# EAGLE schematic LiPoDisp (EAGLE 5.11)
BEST: Farnell 1096979 Bu 1097021
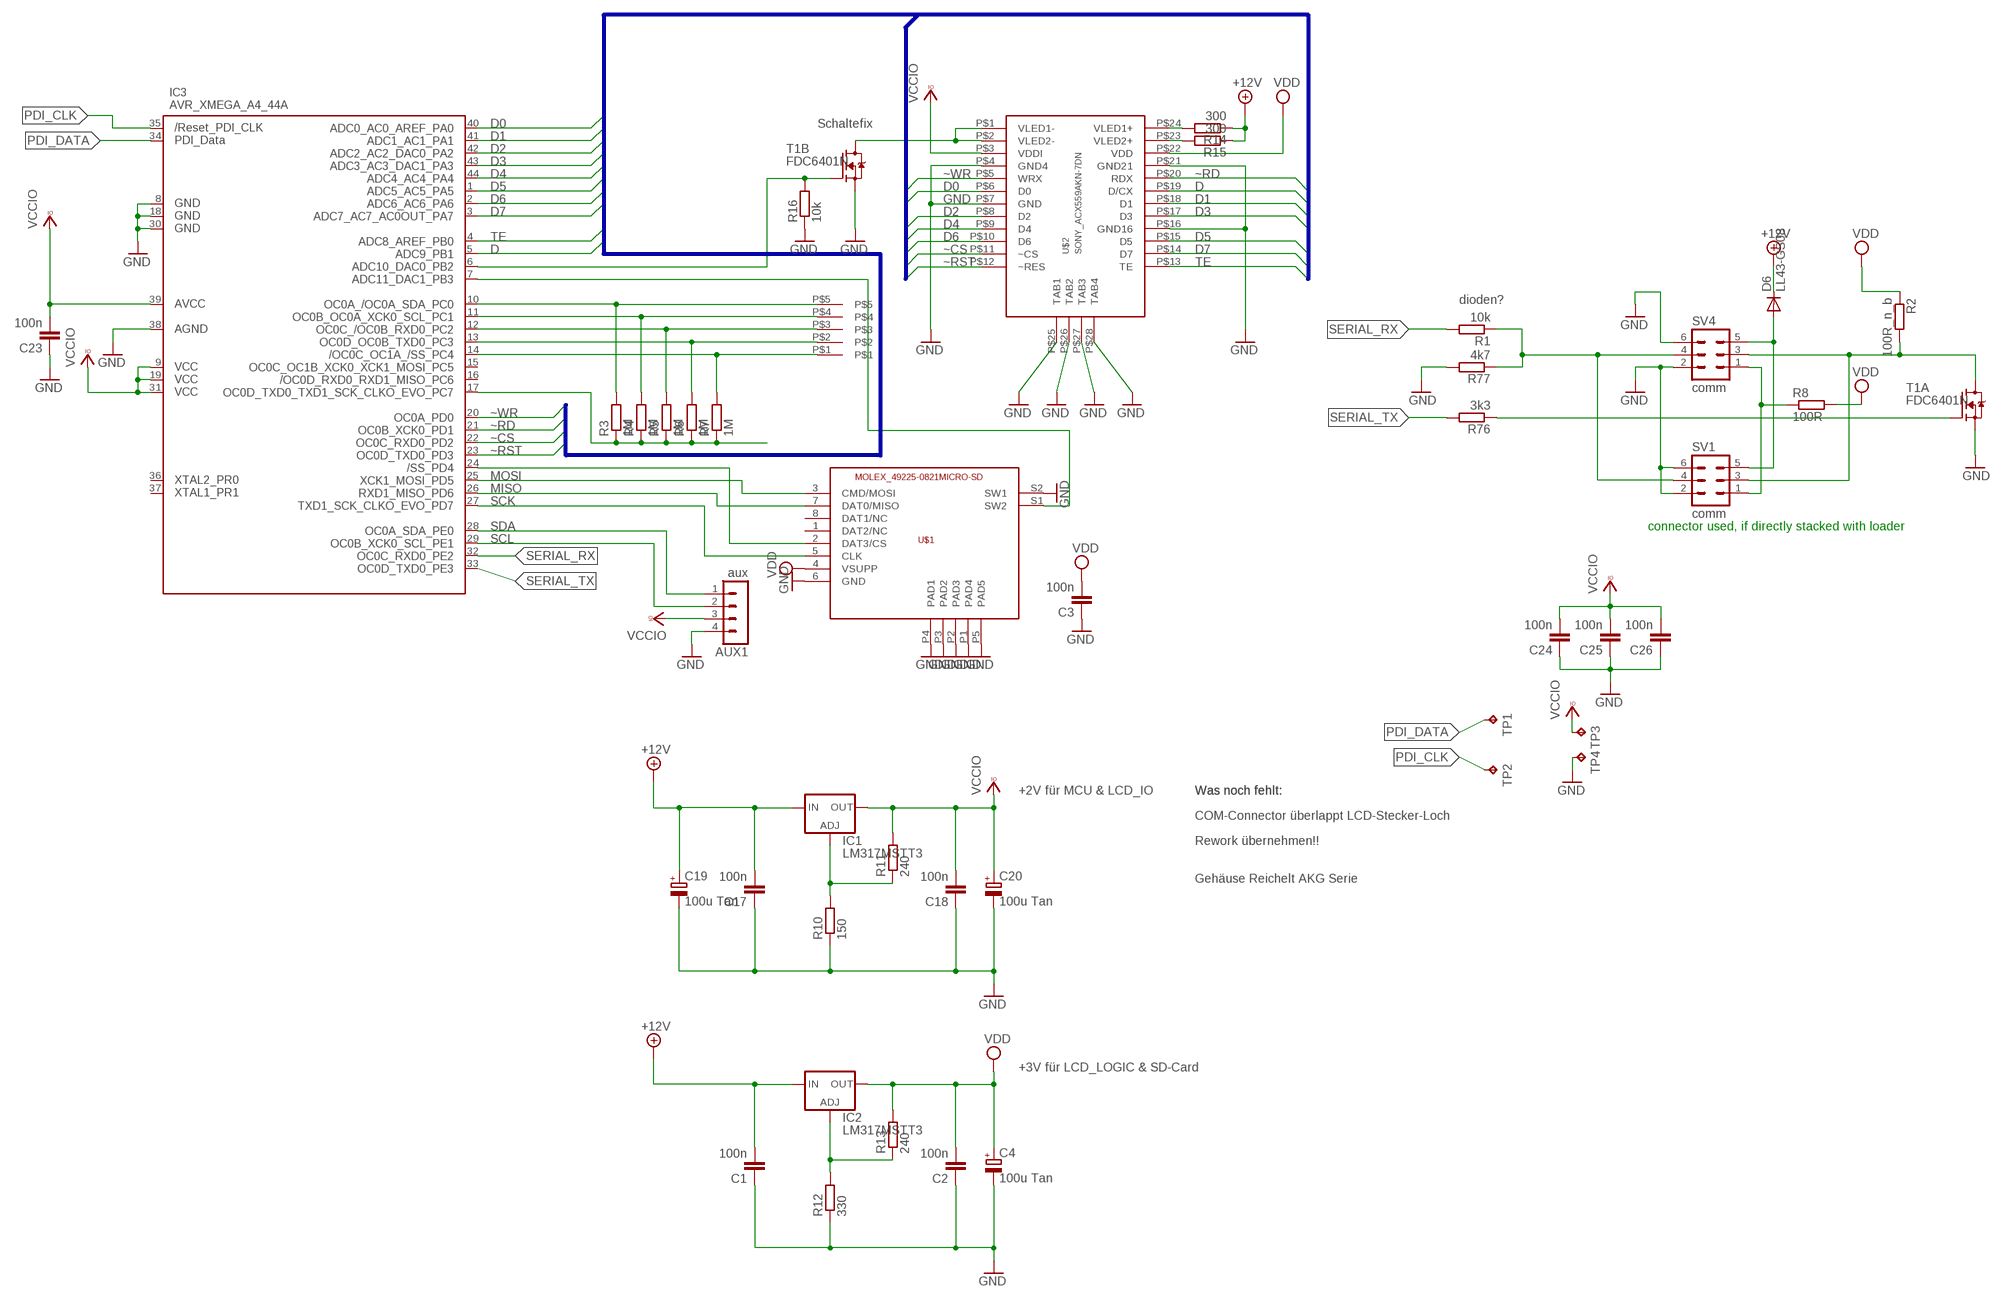
[diagram p0: schematic, sheet 1]

## Parts
AUX1  aux  MA04-1  [MA04-1]
C1  100n  C-EUC0603K  [C0603K]
C2  100n  C-EUC0603K  [C0603K]
C3  100n  C-EUC0603K  [C0603K]
C4  100u Tan  CPOL-EUSMCC  [SMC_C]
C17  100n  C-EUC0603K  [C0603K]
C18  100n  C-EUC0603K  [C0603K]
C19  100u Tan  CPOL-EUSMCC  [SMC_C]
C20  100u Tan  CPOL-EUSMCC  [SMC_C]
C23  100n  C-EUC0603K  [C0603K]
C24  100n  C-EUC0603K  [C0603K]
C25  100n  C-EUC0603K  [C0603K]
C26  100n  C-EUC0603K  [C0603K]
D6  LL43-GS08  DIODE-SOD80C  [SOD80C]
IC1  LM317MSTT3  [SOT223]
IC2  LM317MSTT3  [SOT223]
IC3  AVR_XMEGA_A4_44A  [TQFP44]
P3  PAD5V  PAD5A  [PAD5V]
R1  10k  R-EU_R0603  [R0603]
R2  100R_n_b  R-EU_R1206  [R1206]
R3  1M  R-EU_R0603  [R0603]
R4  1M  R-EU_R0603  [R0603]
R5  1M  R-EU_R0603  [R0603]
R6  1M  R-EU_R0603  [R0603]
R7  1M  R-EU_R0603  [R0603]
R8  100R  R-EU_R1206  [R1206]
R10  150  R-EU_R0603  [R0603]
R11  240  R-EU_R0603  [R0603]
R12  330  R-EU_R0603  [R0603]
R13  240  R-EU_R0603  [R0603]
R14  300  R-EU_R0603  [R0603]
R15  300  R-EU_R0603  [R0603]
R16  10k  R-EU_R0603  [R0603]
R76  3k3  R-EU_R0603  [R0603]
R77  4k7  R-EU_R0603  [R0603]
SV1  comm  ML6L  [ML6L]
SV4  comm  ML6L  [ML6L]
T1  FDC6401N  [SUPERSOT-6]
TP1  TPTP15R  [TP15R]
TP2  TPTP15R  [TP15R]
TP3  TPTP15R  [TP15R]
TP4  TPTP15R  [TP15R]
U$1  MOLEX_49225-0821MICRO-SD  [MOLEX_49225-0821MICRO-SD]
U$2  SONY_ACX559AKN-7DN  [SONY_ACX559AKN-7_A]

## Nets
+12V [Lo-Power]: C1.2 C17.2 C19.+ D6.C IC1.3(IN) IC2.3(IN) R14.1 R15.1
D: IC3.5(PB1) U$2.P$19(D/CX)
D0: IC3.40(PA0) U$2.P$6(D0)
D1: IC3.41(PA1) U$2.P$18(D1)
D2: IC3.42(PA2) U$2.P$8(D2)
D3: IC3.43(PA3) U$2.P$17(D3)
D4: IC3.44(PA4) U$2.P$9(D4)
D5: IC3.1(PA5) U$2.P$15(D5)
D6: IC3.2(PA6) U$2.P$10(D6)
D7: IC3.3(PA7) U$2.P$14(D7)
GND [Lo-Power]: AUX1.4 C1.1 C2.1 C3.1 C4.- C17.1 C18.1 C19.- C20.- C23.1 C24.1 C25.1 C26.1 IC3.8(GND1) IC3.18(GND2) IC3.30(GND3) IC3.38(AGND) R10.1 R12.1 R16.1 R77.2 SV1.2 SV1.6 SV4.2 SV4.6 T1.P$2(B:S) T1.P$5(A:S) TP4.TP U$1.6(GND) U$1.P1(PAD4) U$1.P2(PAD3) U$1.P3(PAD2) U$1.P4(PAD1) U$1.P5(PAD5) U$1.S2(SW1) U$2.P$4(GND4) U$2.P$7(GND) U$2.P$16(GND16) U$2.P$21(GND21) U$2.P$25(TAB1) U$2.P$26(TAB2) U$2.P$27(TAB3) U$2.P$28(TAB4)
MISO: IC3.26(PD6) U$1.7(DAT0/MISO)
MOSI: IC3.25(PD5) U$1.3(CMD/MOSI)
N$1: IC3.7(PB3) U$1.S1(SW2)
N$2 [Lo-Power]: R8.1 SV1.1 SV4.1
N$3: R2.2 SV1.3 SV4.3 T1.P$6(A:D)
N$5: IC3.10(PC0) P3.P$5 R3.2
N$6: IC3.11(PC1) P3.P$4 R4.2
N$7: IC3.12(PC2) P3.P$3 R5.2
N$8: IC3.13(PC3) P3.P$2 R6.2
N$9: IC3.14(PC4) P3.P$1 R7.2
N$10: R76.1 T1.P$1(A:G)
N$13: IC3.17(PC7) R3.1 R4.1 R5.1 R6.1 R7.1
N$14: IC3.24(PD4) U$1.2(DAT3/CS)
N$15: IC1.1(ADJ) R10.2 R11.1
N$16: IC2.1(ADJ) R12.2 R13.1
N$17: T1.P$4(B:D) U$2.P$1(VLED1-) U$2.P$2(VLED2-)
N$18: IC3.6(PB2) R16.2 T1.P$3(B:G)
N$19: R14.2 U$2.P$24(VLED1+)
N$20: R15.2 U$2.P$23(VLED2+)
N$84 [Lo-Power]: D6.A SV1.5 SV4.5
PDI_CLK: IC3.35(RESET) TP2.TP
PDI_DATA: IC3.34(PDI_DATA) TP1.TP
SCK: IC3.27(PD7) U$1.5(CLK)
SCL: AUX1.2 IC3.29(PE1)
SDA: AUX1.1 IC3.28(PE0)
SERIAL_RX: IC3.32(PE2) R1.2
SERIAL_RX_R: R1.1 R77.1 SV1.4 SV4.4
SERIAL_TX: IC3.33(PE3) R76.2
TE: IC3.4(PB0) U$2.P$13(TE)
VCCIO [Lo-Power]: AUX1.3 C18.2 C20.+ C23.2 C24.2 C25.2 C26.2 IC1.4(OUT) IC3.9(VCC1) IC3.19(VCC2) IC3.31(VCC3) IC3.39(AVCC) R11.2 TP3.TP U$2.P$3(VDDI)
VDD [Lo-Power]: C2.2 C3.2 C4.+ IC2.4(OUT) R2.1 R8.2 R13.2 U$1.4(VSUPP) U$2.P$22(VDD)
~CS: IC3.22(PD2) U$2.P$11(~CS)
~RD: IC3.21(PD1) U$2.P$20(RDX)
~RST: IC3.23(PD3) U$2.P$12(~RES)
~WR: IC3.20(PD0) U$2.P$5(WRX)
Unconnected: IC3.15(PC5) IC3.16(PC6) IC3.36(PR0) IC3.37(PR1) U$1.1(DAT2/NC) U$1.8(DAT1/NC)

## Buses
D[0..7],~WR,~RD,~CS,~RST,D,TE

## Notes on the sheet
- Schaltefix
- dioden?
- connector used, if directly stacked with loader
- +2V für MCU & LCD_IO | Was noch fehlt: | Was noch fehlt:
- COM-Connector überlappt LCD-Stecker-Loch
- Rework übernehmen!!
- Gehäuse Reichelt AKG Serie
- +3V für LCD_LOGIC & SD-Card

## Library data of the parts
AUX1 = Fabian:MA04-1: PIN HEADER
C1-C3 C17 C18 C23-C26 = rcl:C-EU: CAPACITOR, European symbol
C4 C19 C20 = rcl:CPOL-EU: POLARIZED CAPACITOR, European symbol
D6 = diode:DIODE-: DIODE
IC1 IC2 = v-reg:LM317?*: 500 mA Adjustable Output Positive Voltage Regulator Source: http://www.onsemi.co.jp .. LM317M-D.PDF
IC3 = xmega:AVR_XMEGA_A4_: Device for Atmel AVR XMEGA A4 Series
P3 = Fabian:PAD5
R1-R8 R10-R16 R76 R77 = rcl:R-EU_: RESISTOR, European symbol
SV1 SV4 = con-harting-ml:ML6: HARTING
T1 = Fabian:FDC6401N: dual n mosfet; BEST: Farnell 1467966
TP1-TP4 = testpad:TP: Test pad
U$1 = Fabian:MOLEX_49225-0821MICRO-SD: MOLEX_49225-0821MICRO-SD
U$2 = Fabian:SONY_ACX559AKN-7: SONY ACX559AKN-7 full Color display matching connector JST-JAN 24R-JANK-GSAN-TF

## Net classes
1 Hi-Power: width 0.3 mm
2 Lo-Power: width 0.3 mm